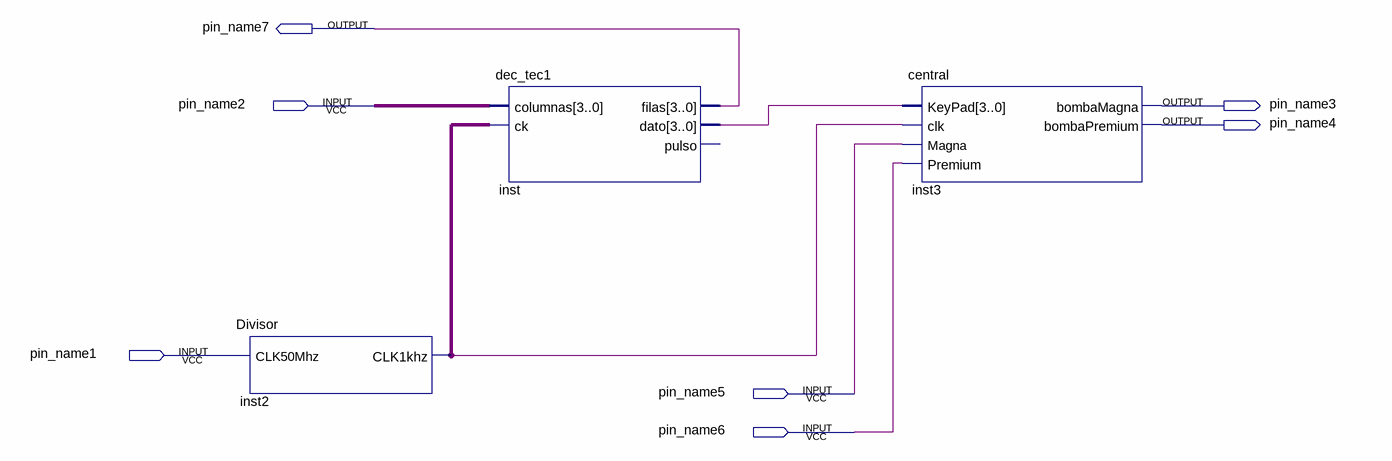
[diagram p0: schematic sheet]
// Quartus schematic ProyectoHD.bdf as structural Verilog: 3 symbols, 7 pins
module ProyectoHD (
  input  pin_name2,
  input  pin_name1,
  input  pin_name5,
  input  pin_name6,
  output pin_name7,
  output pin_name3,
  output pin_name4
);

  wire inst2_clk1khz;
  wire [3:0] inst_dato, undriven;

  Divisor inst2 (.CLK50Mhz(pin_name1), .CLK1khz(inst2_clk1khz));
  dec_tec1 inst (.columnas(undriven), .ck(inst2_clk1khz), .filas(pin_name7), .dato(inst_dato));  // open: pulso
  central inst3 (
    .KeyPad(inst_dato), .clk(inst2_clk1khz), .Magna(pin_name5), .Premium(pin_name6), .bombaMagna(pin_name3),
    .bombaPremium(pin_name4));
endmodule
